# Altium project Preamp.PrjPCB
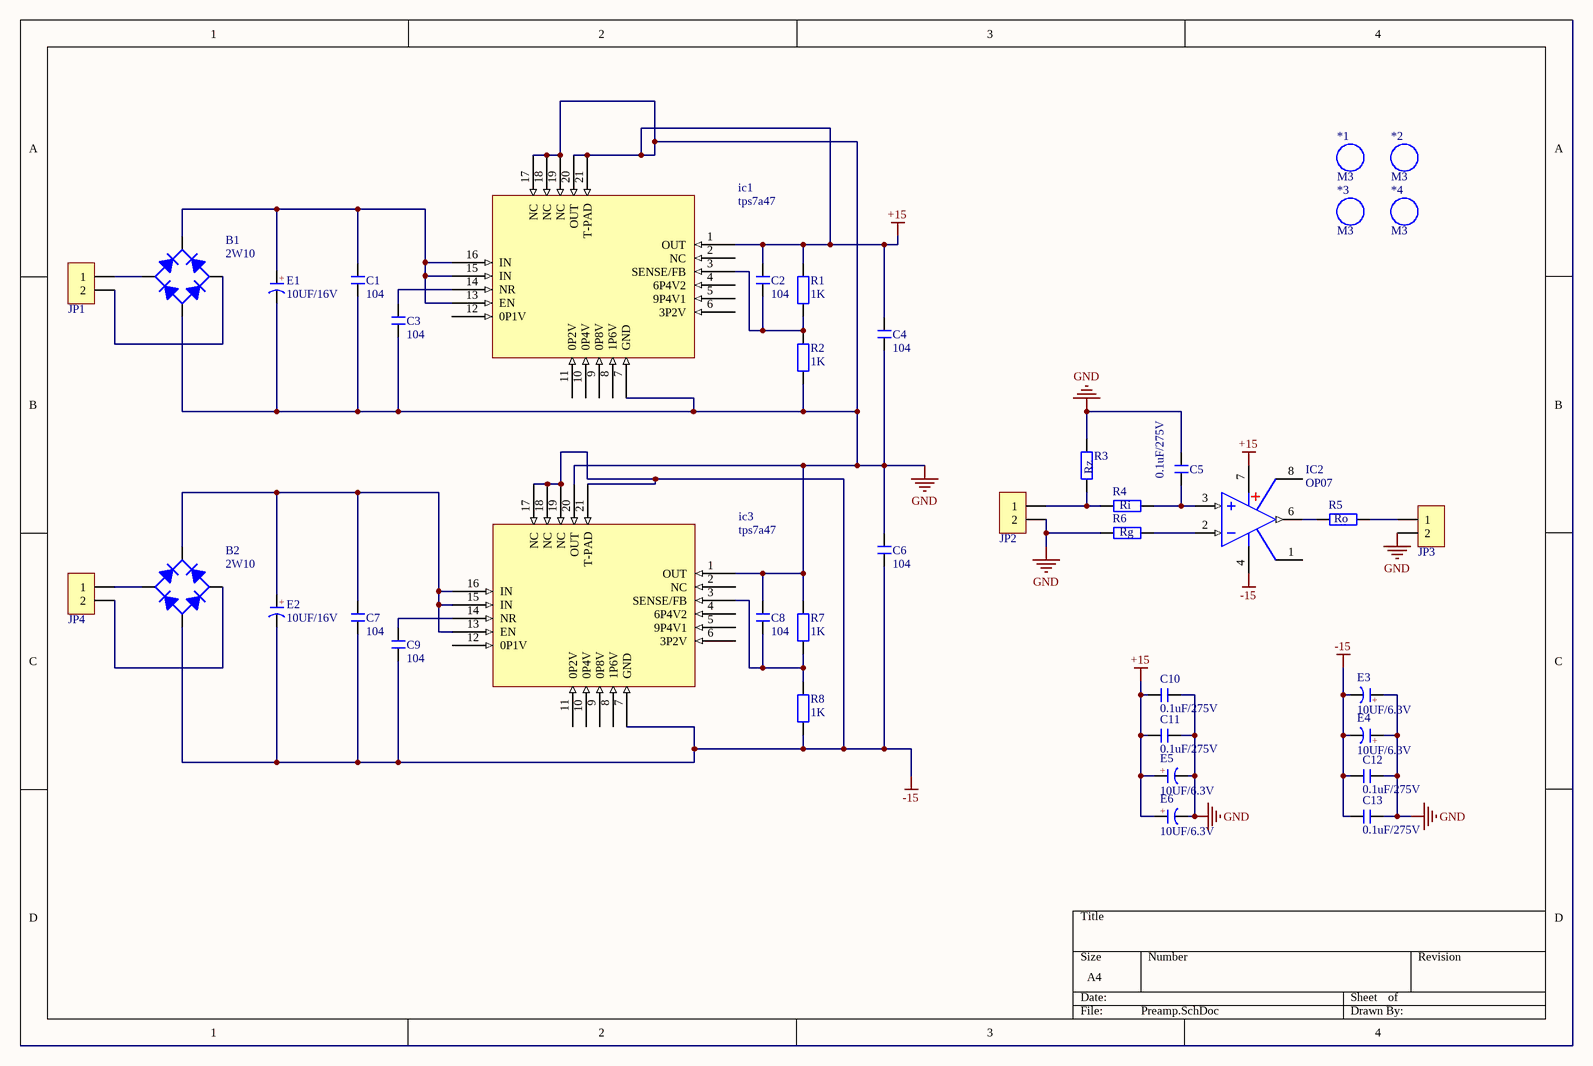
[diagram p0: Preamp.SchDoc]
1 sheet, 40 parts. Net scope: global (net labels, ports and power ports of the same name join across sheets).
Board file: Preamp.PcbDoc

## Sheet Preamp.SchDoc
size A4

### Parts
*1  M3  [M3 125X300]
*2  M3  [M3 125X300]
*3  M3  [M3 125X300]
*4  M3  [M3 125X300]
B1  2W10  [RB-20]
B2  2W10  [RB-20]
C1  104  [C 0603]
C2  104  [C 0603]
C3  104  [C 0603]
C4  104  [C 0603]
C5  0.1uF/275V  [CBB-CL71]
C6  104  [C 0603]
C7  104  [C 0603]
C8  104  [C 0603]
C9  104  [C 0603]
C10  0.1uF/275V  [CBB-CL71]
C11  0.1uF/275V  [CBB-CL71]
C12  0.1uF/275V  [CBB-CL71]
C13  0.1uF/275V  [CBB-CL71]
E1  10UF/16V  [CAP 7.5*18*35.5]
E2  10UF/16V  [CAP 7.5*18*35.5]
E3  10UF/6.3V  [CS 5.0*10*13 - C]
E4  10UF/6.3V  [CS 5.0*10*13 - C]
E5  10UF/6.3V  [CS 5.0*10*13 - C]
E6  10UF/6.3V  [CS 5.0*10*13 - C]
ic1  tps7a47  [QFN65P500X500X100_HS-21N]
IC2  OP07  [DIP8-300]
ic3  tps7a47  [QFN65P500X500X100_HS-21N]
JP1  HDR-1X2  [KF2EDGK5.08-2P]  (value not drawn)
JP2  HDR-1X2  [KF2EDGK5.08-2P]  (value not drawn)
JP3  HDR-1X2  [KF2EDGK5.08-2P]  (value not drawn)
JP4  HDR-1X2  [KF2EDGK5.08-2P]  (value not drawn)
R1  1K  [R 0805]
R2  1K  [R 0805]
R3  Rz  [RS 1/2W]
R4  Ri  [RS 1/2W]
R5  Ro  [RS 1/2W]
R6  Rg  [RS 1/2W]
R7  1K  [R 0805]
R8  1K  [R 0805]

### Nets
+15: B1.DC- C1.1 C2.2 C3.1 C4.1 C4.2 C5.2 C6.2 C8.2 C10.1 C10.2 C11.1 C11.2 C12.2 C13.2 E1.2(K) E3.1(A) E4.1(A) E5.1(A) E5.2(K) E6.1(A) E6.2(K) ic1.1(OUT) ic1.7(GND) ic1.17(NC) ic1.18(NC) ic1.19(NC) ic1.20(OUT) ic1.21(T-PAD) IC2.7(V+) ic3.1(OUT) ic3.20(OUT) JP2.2 JP3.2 R1.2 R2.1 R3.2 R6.1 R7.2  [also labelled GND]
-15: B2.DC- C6.1 C7.1 C9.1 C12.1 C13.1 E2.2(K) E3.2(K) E4.2(K) IC2.4(V-) ic3.7(GND) ic3.17(NC) ic3.18(NC) ic3.19(NC) ic3.21(T-PAD) R8.1
NetB1_AC1: B1.AC1 JP1.1
NetB1_AC2: B1.AC2 JP1.2
NetB1_DC+: B1.DC+ C1.2 E1.1(A) ic1.13(EN) ic1.15(IN) ic1.16(IN)
NetB2_AC1: B2.AC1 JP4.1
NetB2_AC2: B2.AC2 JP4.2
NetB2_DC+: B2.DC+ C7.2 E2.1(A) ic3.13(EN) ic3.15(IN) ic3.16(IN)
NetC2_1: C2.1 ic1.3(SENSE/FB) R1.1 R2.2
NetC3_2: C3.2 ic1.14(NR)
NetC5_1: C5.1 IC2.3(IN+) R4.2
NetC8_1: C8.1 ic3.3(SENSE/FB) R7.1 R8.2
NetC9_2: C9.2 ic3.14(NR)
NetIC2_2: IC2.2(IN-) R6.2
NetIC2_6: IC2.6(OUT) R5.1
NetJP2_1: JP2.1 R3.1 R4.1
NetJP3_1: JP3.1 R5.2

Not connected (* = marked no-connect by the designer): ic1 2(NC) 4(6P4V2) 5(9P4V1) 6(3P2V) 8(1P6V) 9(0P8V) 10(0P4V) 11(0P2V) 12(0P1V); IC2 1 8; ic3 2(NC) 4(6P4V2) 5(9P4V1) 6(3P2V) 8(1P6V) 9(0P8V) 10(0P4V) 11(0P2V) 12(0P1V)

### Notes on the sheet
- (in symbol C-CAP) +
- (in symbol C-CS) +

### Library data of the parts
*1-*4 = M3: 铜柱孔; 版权归属: 源创客; BOM名称: 铜柱孔; 学习资源: www.ooocke.com
B1 B2 = 2W10: 1KV/2A淕霜; 唳寥扽: 埭斐諦; BOM靡備: 1KV/2A淕霜; 悝炾訧埭: www.ooocke.com
C1-C4 C6-C9 = C: 拸憤俶泂萇; 唳寥扽: 埭斐諦; BOM靡備: 拸憤俶泂萇; 悝炾訧埭: www.ooocke.com
C5 C10-C13 = C-CBB: CBB萇; 唳寥扽: 埭斐諦; BOM靡備: CBB萇; 悝炾訧埭: www.ooocke.com
E1 E2 = C-CAP: 眻脣萇賤萇; 唳寥扽: 埭斐諦; BOM靡備: 眻脣萇賤萇; 悝炾訧埭: www.ooocke.com
E3-E6 = C-CS: 眻脣嘐怓萇; 唳寥扽: 埭斐諦; BOM靡備: 眻脣嘐怓萇; 悝炾訧埭: www.ooocke.com
ic1 ic3 = tps7a47: TI RF LDO Voltage Regulator; Supplier 1: Arrow
IC2 = OP07: 单路精密运放; 版权归属: 源创客; BOM名称: 单路精密运放; 学习资源: www.ooocke.com
JP1-JP4 = Header 2: 2P諉脣璃; 唳寥扽: 埭斐諦; BOM靡備: 2P諉脣璃; 悝炾訧埭: www.ooocke.com
R1 R2 R7 R8 = R: 泂萇郯; 唳寥扽: 埭斐諦; BOM靡備: 泂萇郯; 悝炾訧埭: www.ooocke.com
R3 R4 R6 = R-CRR: 眻脣伎遠萇郯; BOM靡備: 伎遠萇郯; 唳寥扽: 埭斐諦; 悝炾訧埭: www.ooocke.com
R5 = R-CRR: BOM靡備: 伎遠萇郯; 唳寥扽: 埭斐諦; 悝炾訧埭: www.ooocke.com